# Altium schematic sheet edge_dff_clk_low.SchDoc
size A4
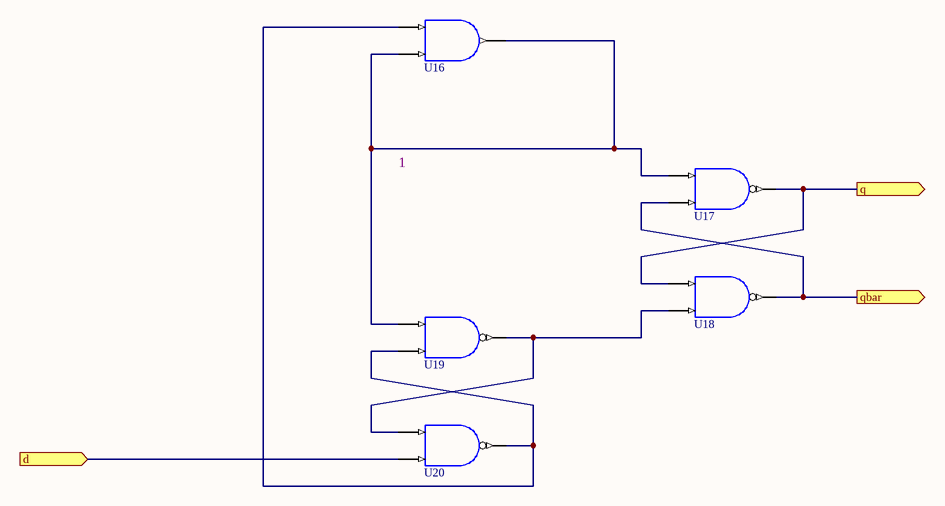
[diagram p0: edge_dff_clk_low.SchDoc]

## Parts
U16  AND 2  (value not drawn)
U17  AND 2  (value not drawn)
U18  AND 2  (value not drawn)
U19  AND 2  (value not drawn)
U20  AND 2  (value not drawn)

## Ports
d (in), q (out), qbar (out)

## Nets
d: U20.B ; port d
q: U17.Y U18.A ; port q
qbar: U17.B U18.Y ; port qbar
NetU16_A: U16.A U19.B U20.Y
NetU16_B: U16.B U16.Y U17.A U19.A
NetU18_B: U18.B U19.Y U20.A

## Notes on the sheet
- 1

## Library data of the parts
U16-U20 = AND_2: 2 Input AND